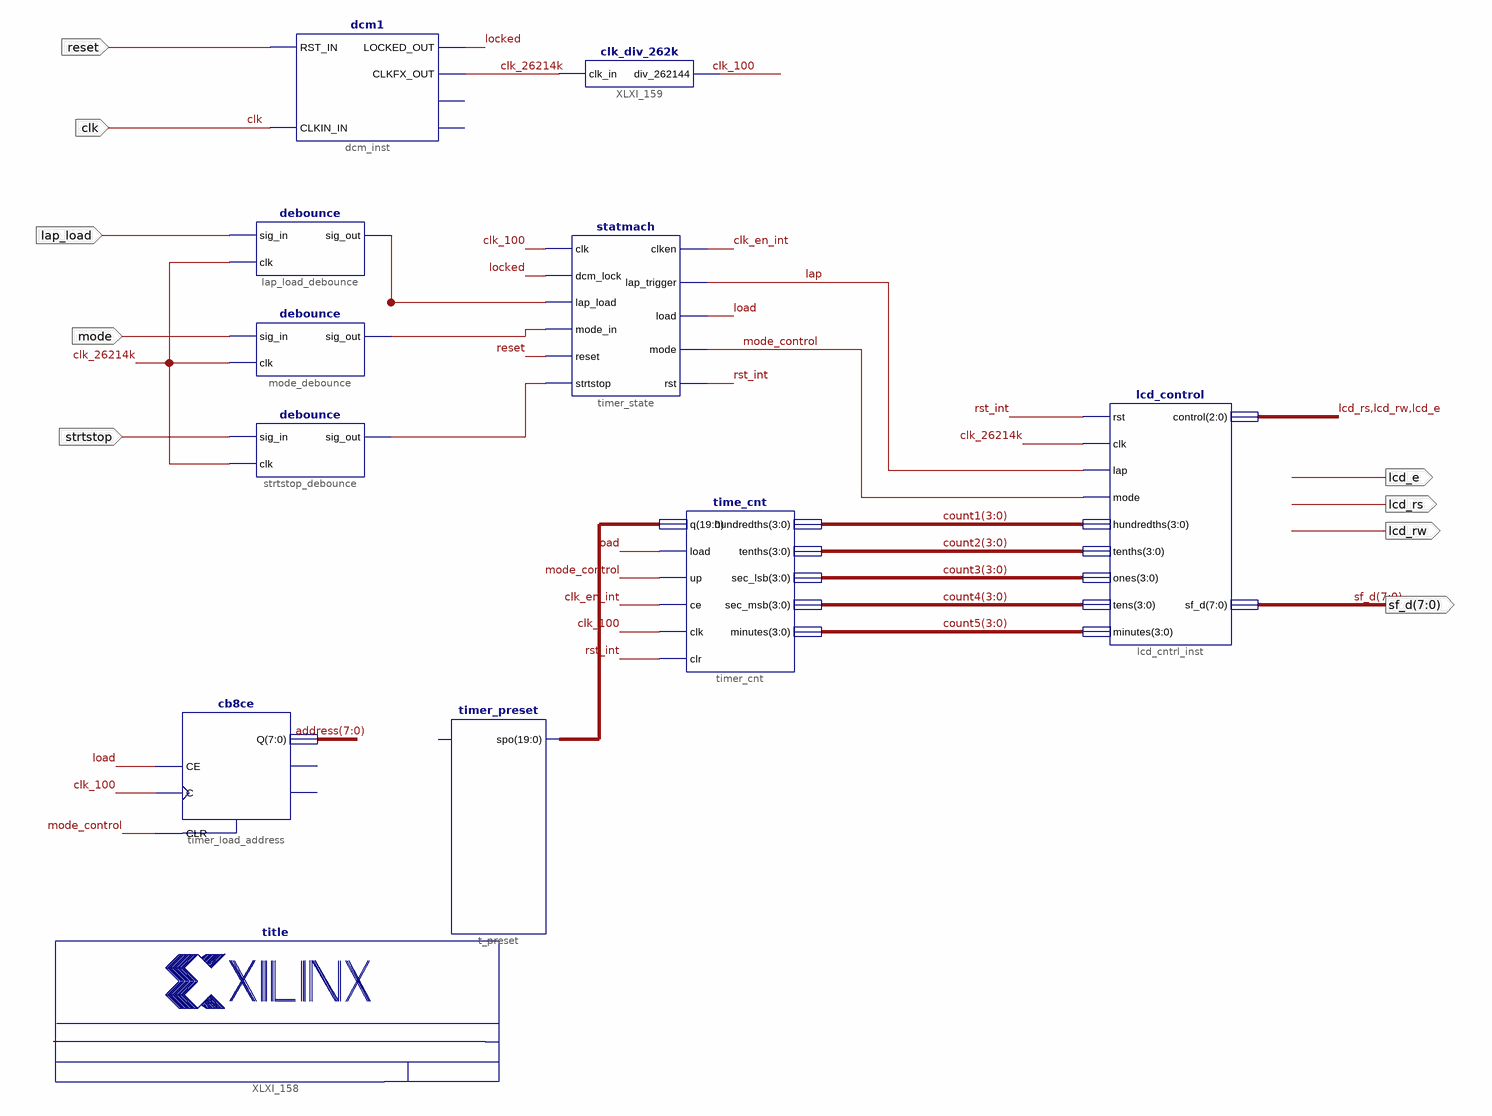
[diagram p0: schematic sheet 1]
// Xilinx ISE schematic stopwatch.sch (spartan3a) as structural Verilog: 11 symbols, 9 ports
module stopwatch (
  input  clk,
  input  lap_load,
  input  mode,
  input  reset,
  input  strtstop,
  output [7:0] sf_d,
  output lcd_rw,
  output lcd_rs,
  output lcd_e
);

  wire clk_100, clk_26214k, clk_en_int, lap, load, locked, mode_control, rst_int, XLXN_16, XLXN_21, XLXN_22;
  wire [3:0] count1, count2, count3, count4, count5;
  wire [7:0] address;
  wire [19:0] XLXN_31;

  title #(.TitleFieldText("Stop Watch Tutorial"), .NameFieldText("Mr.Tutorial")) XLXI_158 ();
  lcd_control lcd_cntrl_inst (
    .rst(rst_int), .clk(clk_26214k), .lap(lap), .control({lcd_rs, lcd_rw, lcd_e}), .sf_d(sf_d),
    .hundredths(count1), .tenths(count2), .ones(count3), .tens(count4), .minutes(count5), .mode(mode_control));
  cb8ce timer_load_address (.C(clk_100), .CE(load), .CLR(mode_control), .Q(address));  // open: CEO, TC
  clk_div_262k XLXI_159 (.clk_in(clk_26214k), .div_262144(clk_100));
  time_cnt timer_cnt (
    .ce(clk_en_int), .clk(clk_100), .clr(rst_int), .hundredths(count1), .load(load), .minutes(count5),
    .q(XLXN_31), .sec_lsb(count3), .sec_msb(count4), .tenths(count2), .up(mode_control));
  timer_preset t_preset (.spo(XLXN_31));  // open: a
  debounce lap_load_debounce (.sig_in(lap_load), .clk(clk_26214k), .sig_out(XLXN_16));
  debounce mode_debounce (.sig_in(mode), .clk(clk_26214k), .sig_out(XLXN_21));
  debounce strtstop_debounce (.sig_in(strtstop), .clk(clk_26214k), .sig_out(XLXN_22));
  statmach timer_state (
    .clk(clk_100), .dcm_lock(locked), .lap_load(XLXN_16), .mode_in(XLXN_21), .reset(reset),
    .strtstop(XLXN_22), .clken(clk_en_int), .lap_trigger(lap), .load(load), .mode(mode_control), .rst(rst_int));
  dcm1 dcm_inst (
    .RST_IN(reset), .CLKIN_IN(clk), .LOCKED_OUT(locked), .CLKFX_OUT(clk_26214k));  // open: CLKIN_IBUFG_OUT, CLK0_OUT

  // Notes on the sheet:
  //   LOC on signal sf_d(7:0) = Y15,AB16,Y12,AA12,AB12,AB17,AB18,Y13
  //   LOC on signal lcd_rw = W13
  //   LOC on signal lcd_rs = Y14
  //   LOC on signal lcd_e = AB4
  //   LOC on signal clk = E12
endmodule
